# EAGLE design tree (EAGLE 7.7.0)
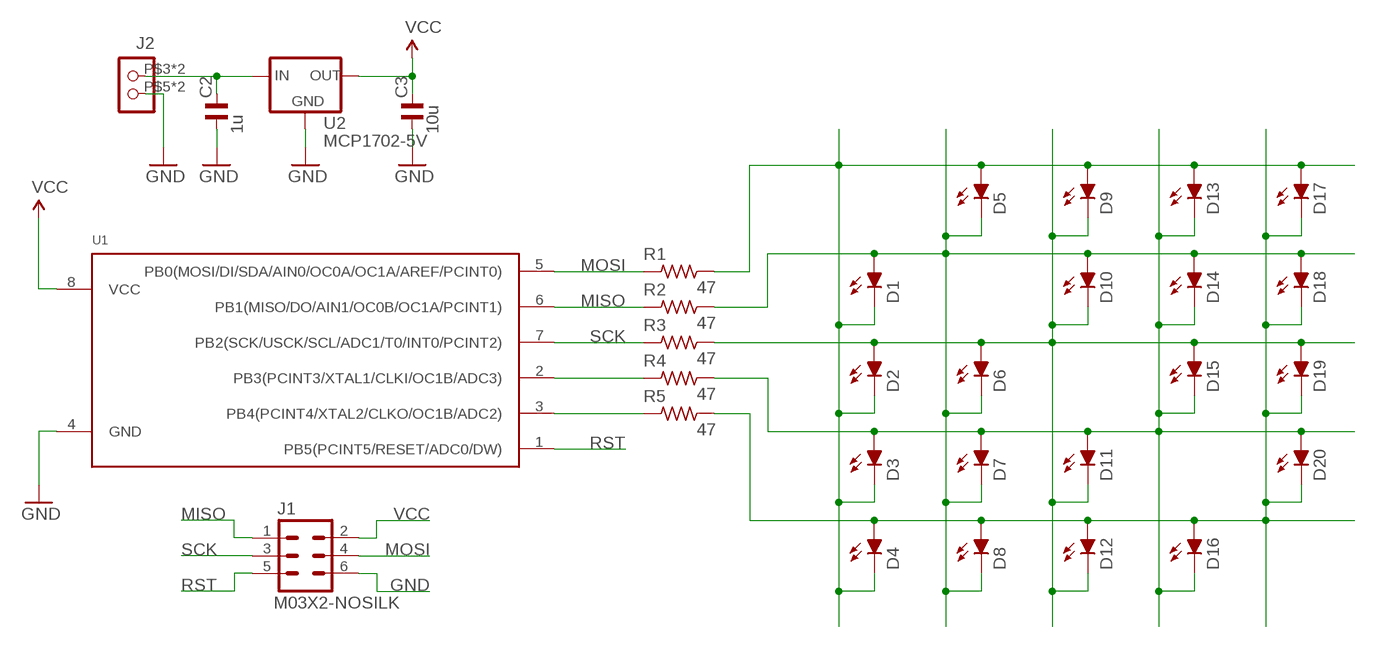
[diagram p0: schematic, sheet 1]

## Parts
C2  1u  C_0805NOSILK  [C0805NOSILK]
C3  10u  C_0805NOSILK  [C0805NOSILK]
D1  LEDCHIP-LED0805NOSILK  [CHIP-LED0805NOSILK]
D2  LEDCHIP-LED0805NOSILK  [CHIP-LED0805NOSILK]
D3  LEDCHIP-LED0805NOSILK  [CHIP-LED0805NOSILK]
D4  LEDCHIP-LED0805NOSILK  [CHIP-LED0805NOSILK]
D5  LEDCHIP-LED0805NOSILK  [CHIP-LED0805NOSILK]
D6  LEDCHIP-LED0805NOSILK  [CHIP-LED0805NOSILK]
D7  LEDCHIP-LED0805NOSILK  [CHIP-LED0805NOSILK]
D8  LEDCHIP-LED0805NOSILK  [CHIP-LED0805NOSILK]
D9  LEDCHIP-LED0805NOSILK  [CHIP-LED0805NOSILK]
D10  LEDCHIP-LED0805NOSILK  [CHIP-LED0805NOSILK]
D11  LEDCHIP-LED0805NOSILK  [CHIP-LED0805NOSILK]
D12  LEDCHIP-LED0805NOSILK  [CHIP-LED0805NOSILK]
D13  LEDCHIP-LED0805NOSILK  [CHIP-LED0805NOSILK]
D14  LEDCHIP-LED0805NOSILK  [CHIP-LED0805NOSILK]
D15  LEDCHIP-LED0805NOSILK  [CHIP-LED0805NOSILK]
D16  LEDCHIP-LED0805NOSILK  [CHIP-LED0805NOSILK]
D17  LEDCHIP-LED0805NOSILK  [CHIP-LED0805NOSILK]
D18  LEDCHIP-LED0805NOSILK  [CHIP-LED0805NOSILK]
D19  LEDCHIP-LED0805NOSILK  [CHIP-LED0805NOSILK]
D20  LEDCHIP-LED0805NOSILK  [CHIP-LED0805NOSILK]
J1  M03X2-NOSILK  [2X03_LOCK_NOSILK]
J2  CON_TERMINAL_HOLES  [TERMINAL_2P_4H]
R1  47  R_0805NOSILK  [R0805NOSILK]
R2  47  R_0805NOSILK  [R0805NOSILK]
R3  47  R_0805NOSILK  [R0805NOSILK]
R4  47  R_0805NOSILK  [R0805NOSILK]
R5  47  R_0805NOSILK  [R0805NOSILK]
U1  ATTINY5-20SU-NOSILK  [SOP8-8S2-NOSILK]
U2  MCP1702-5V  V_REG_MCP170X-CB-NOSILK  [SOT23_NOSILK]

## Nets
GND: C2.1 C3.1 J1.6 J2.P$5 J2.P$6 U1.4(GND) U2.1(GND)
MISO: J1.1 R2.1 U1.6(PB1(MISO/DO/AIN1/OC0B/OC1A/PCINT1))
MOSI: J1.4 R1.1 U1.5(PB0(MOSI/DI/SDA/AIN0/OC0A/OC1A/AREF/PCINT0))
N$1: C2.2 J2.P$3 J2.P$4 U2.3(IN)
N$4: R4.1 U1.2(PB3(PCINT3/XTAL1/CLKI/OC1B/ADC3))
N$5: R5.1 U1.3(PB4(PCINT4/XTAL2/CLKO/OC1B/ADC2))
N$7: D2.A D6.A D9.C D10.C D11.C D12.C D15.A D19.A R3.2
N$8: D1.A D5.C D6.C D7.C D8.C D10.A D14.A D18.A R2.2
N$9: D1.C D2.C D3.C D4.C D5.A D9.A D13.A D17.A R1.2
N$10: D3.A D7.A D11.A D13.C D14.C D15.C D16.C D20.A R4.2
N$11: D4.A D8.A D12.A D16.A D17.C D18.C D19.C D20.C R5.2
RST: J1.5 U1.1(PB5(PCINT5/RESET/ADC0/DW))
SCK: J1.3 R3.1 U1.7(PB2(SCK/USCK/SCL/ADC1/T0/INT0/PCINT2))
VCC: C3.2 J1.2 U1.8(VCC) U2.2(OUT)

## Library data of the parts
C2 C3 = snowflake:C_: NON-POLARIZED CAP
D1-D20 = snowflake:LED: LED Various Types
J1 = snowflake:M03X2: This is a 3x2 pin header Note: This part is based on the Sparkfun M04X2 header.
J2 = adi-misc:CON_TERMINAL_HOLES
R1-R5 = snowflake:R_: RESISTOR
U1 = snowflake:ATTINY*5: Atmel 8-bit AVR Microcontroller with 2/4/8K Bytes In-System Programmable Flash
U2 = snowflake:V_REG_MCP170X

## Board
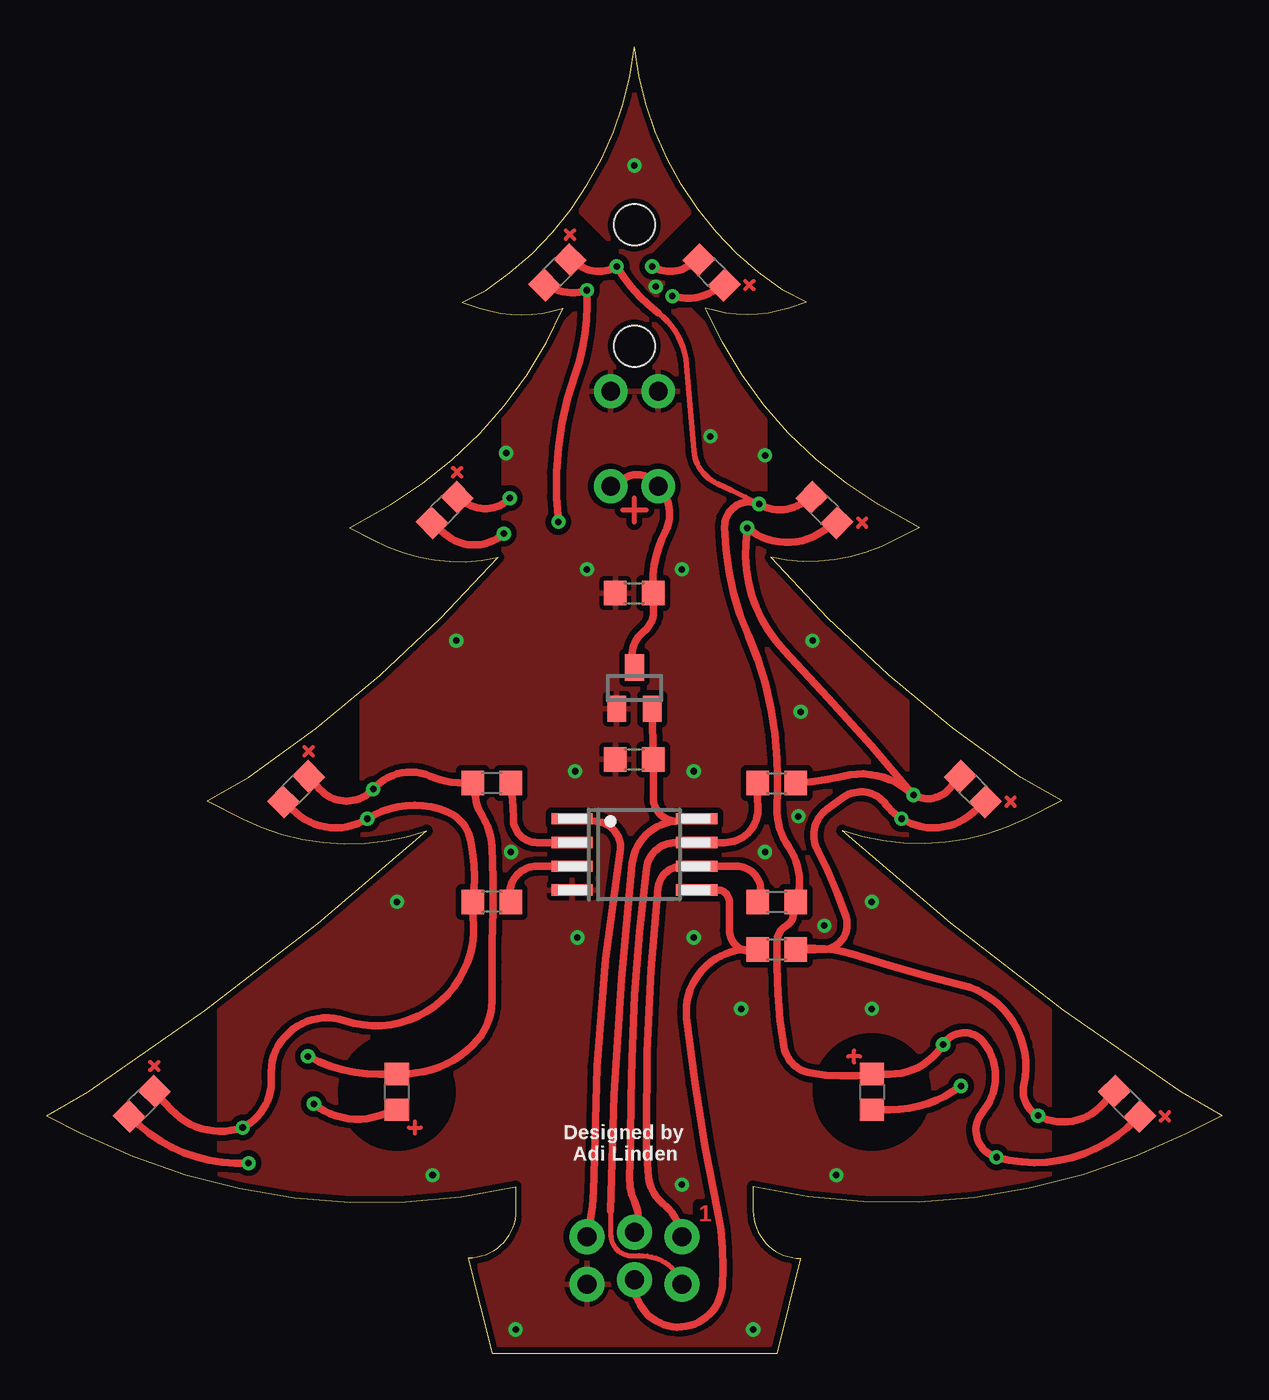
[diagram p1: board, top side]
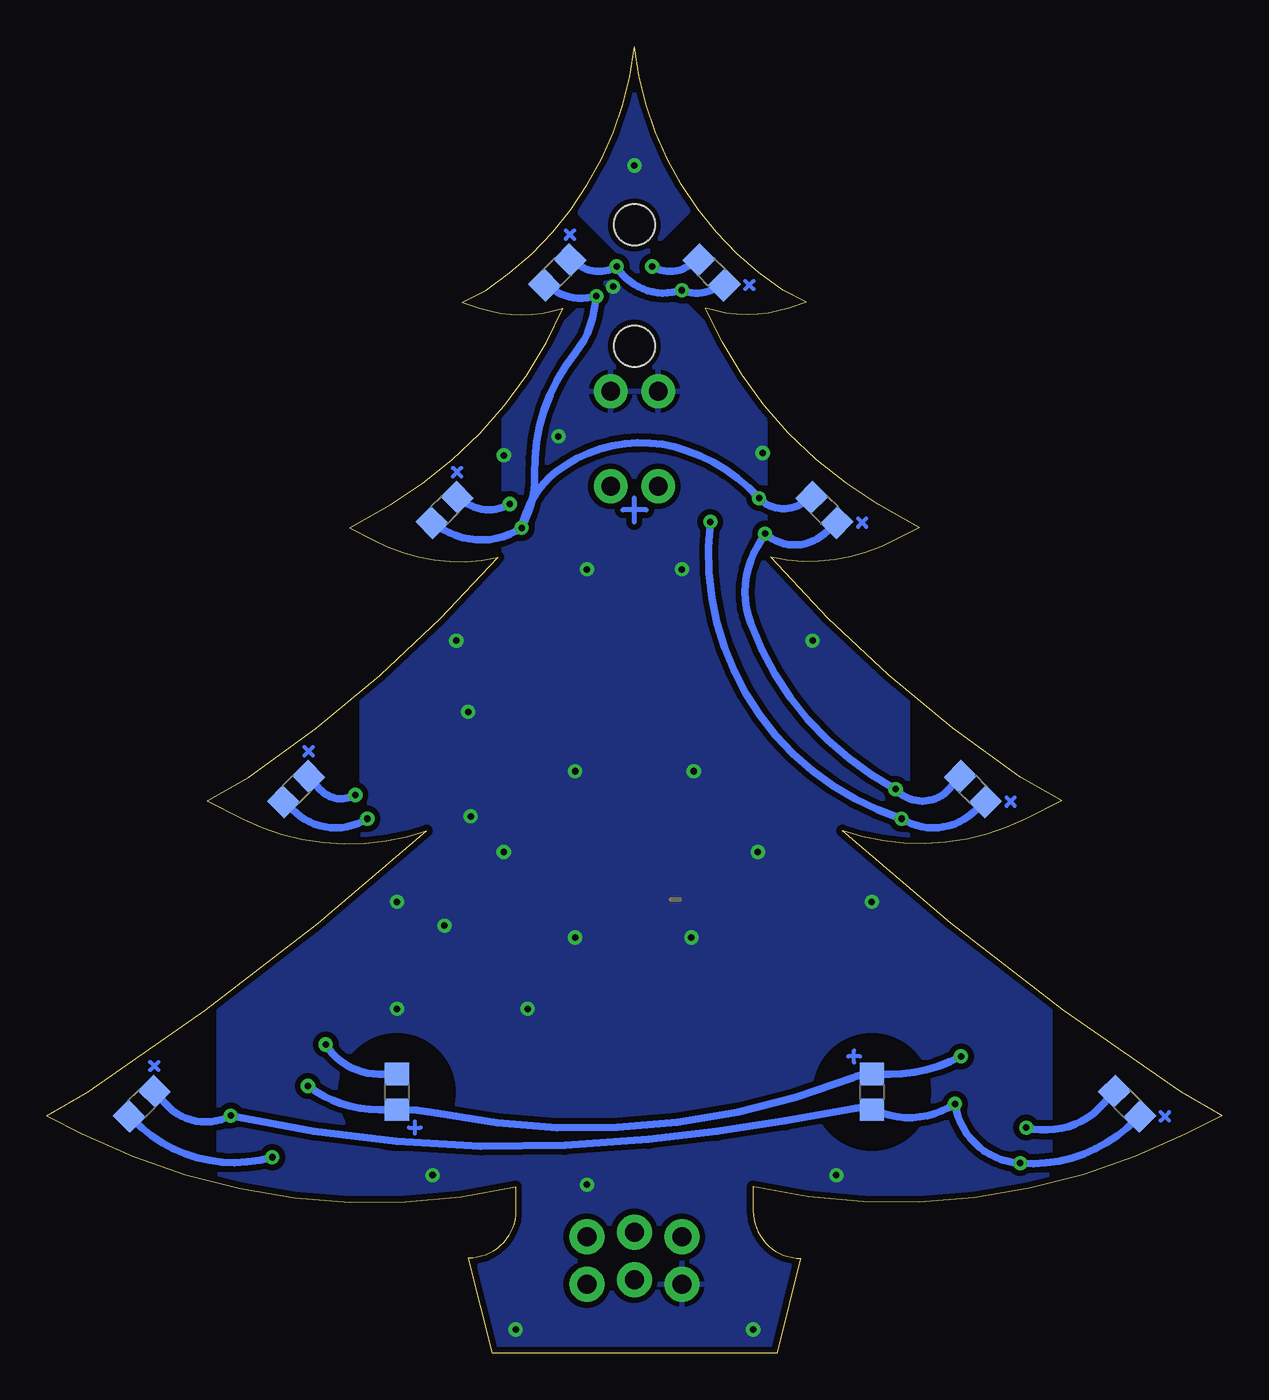
[diagram p2: board, bottom side, seen from below]

Size 62.86 x 69.85 mm. Coordinates in mm from the lower left corner, seen from the top.
Outline: 0,12.7 1.91,11.75 arc39 25.08,8.89 25.08,7.62 arc-90 22.54,5.08 23.81,0 39.05,0 40.32,5.08 arc-90 37.78,7.62 37.78,8.89 arc39 60.96,11.75 62.86,12.7 60.64,13.97 arc-8 42.54,27.94 arc46 52.39,28.57 54.29,29.53 52.07,30.8 arc-14 38.74,42.55 arc41 45.4,43.5 46.67,44.13 44.45,45.4 arc-36 35.24,55.88 arc37 39.69,55.88 40.64,56.2 39.37,56.83 arc-50 31.43,69.85 arc-50 23.49,56.83 22.23,56.2 23.18,55.88 arc37 27.62,55.88 arc-36 18.42,45.4 16.19,44.13 17.46,43.5 arc41 24.13,42.55 arc-14 10.8,30.8 8.57,29.53 10.48,28.57 arc46 20.32,27.94 arc-8 2.22,13.97 0,12.7
Copper layers (1*16): Top 0.035mm / dielectric 1.5mm / Bottom 0.035mm
Design rules "SeeedStudio_2layer_DRU_no_angle_20140221 *": minimum track width 6mil, minimum drill 12mil, track to track 6mil, track to pad 6mil, pad to pad 6mil, via to via 6mil, smd to smd 0mil, copper to edge 10mil, drill to drill 10mil, minimum pad ring 10mil, minimum via ring 8mil, stop-mask expansion 2mil, vias tented up to drill 25mil, thermal gap 10mil
Holes 2.2 mm at 31.43,53.85 31.43,60.33
tRestrict: area -0.3,8.9 to 8.6,19.1; area 54.3,8.9 to 63.2,19.1; area 8.6,26.7 to 16.2,35.6; area 46.7,26.7 to 54.3,35.6; area 16.2,42.3 to 23.8,49.9; area 22,55.5 to 30.2,61.1; area 32.7,55.4 to 40.3,61; area 39.1,42.4 to 46.7,50; area 15.9,11.1 to 21.6,16.8; area 41.3,11.1 to 47,16.8
bRestrict: area 32.7,55.4 to 40.3,61; area 22,55.5 to 30.2,61.1; area 16.2,42.3 to 23.8,49.9; area 8.6,26.7 to 16.2,35.6; area 46.7,26.7 to 54.3,35.6; area -0.3,8.9 to 8.6,19.1; area 54.3,8.9 to 63.2,19.1; area 39.1,42.4 to 46.7,50; area 15.9,11.1 to 21.6,16.8; area 41.3,11.1 to 47,16.8

### Footprints (pad centres in the part's own frame; a part is rotated, then mirrored left to right if it is on the bottom)
C0805NOSILK = smd 1.2 x 1.3: 1 -1.016,0; 2 1.016,0
CHIP-LED0805NOSILK = smd 1.3 x 1.2: A 0,-0.953; C 0,0.953
2X03_LOCK_NOSILK = drill 1.016 pad 1.88: 1 -2.54,-1.143; 2 -2.54,1.397; 3 0,-1.397; 4 0,1.143; 5 2.54,-1.143; 6 2.54,1.397
TERMINAL_2P_4H = drill 1 pad 1.8: P$3 -2.54,1.27; P$4 -2.54,-1.27; P$5 2.54,1.27; P$6 2.54,-1.27
R0805NOSILK = smd 1.2 x 1.3: 1 -1.016,0; 2 1.016,0
SOP8-8S2-NOSILK = smd 0.6 x 2.2: 1 -1.905,-3.33; 2 -0.635,-3.33; 3 0.635,-3.33; 4 1.905,-3.33; 5 1.905,3.33; 6 0.635,3.33; 7 -0.635,3.33; 8 -1.905,3.33
SOT23_NOSILK = smd 1 x 1.4: 1 -0.95,-1.1; 2 0.95,-1.1; 3 0,1.1

### Placement (x,y rotation side)
C2  31.43,40.64 0 top
C3  31.43,31.75 0 top
D1  57.78,13.34 45 top
D2  49.53,30.16 135 bottom
D3  18.73,13.97 180 bottom
D4  5.08,13.34 135 top
D5  57.78,13.34 135 bottom
D6  41.59,45.09 45 top
D7  44.13,13.97 0 bottom
D8  27.3,57.78 45 bottom
D9  49.53,30.16 45 top
D10  41.59,45.09 135 bottom
D11  21.27,45.09 45 bottom
D12  35.56,57.78 135 bottom
D13  18.73,13.97 0 top
D14  44.13,13.97 180 top
D15  21.27,45.09 135 top
D16  13.33,30.16 45 bottom
D17  5.08,13.34 45 bottom
D18  27.3,57.78 135 top
D19  35.56,57.78 45 top
D20  13.33,30.16 135 top
J1  31.43,5.08 180 top
J2  31.43,48.9 90 top
R1  39.05,21.59 0 top
R2  39.05,24.13 0 top
R3  39.05,30.48 0 top
R4  23.81,30.48 180 top
R5  23.81,24.13 180 top
U1  31.43,26.67 270 top
U2  31.43,35.56 0 top

### Tracks (layer width: path | path; a pad name or v marks a point on that pad's centre or on a via)
GND  (via drill 0.35)
  other vias: 28.89,41.91 33.97,41.91 35.5,49.02 38.42,48.01 21.91,38.1 40.96,38.1 34.61,31.11 28.26,31.11 40.32,34.29 24.83,26.8 38.42,26.8 18.73,24.13 44.13,24.13 40.2,28.7 41.59,22.86 34.61,22.23 28.38,22.23 20.64,9.53 42.23,9.53 44.13,18.41 33.97,9.02 37.78,1.27 25.08,1.27 37.15,18.41 24.57,48.13 32.58,57.02 31.43,63.5
  pour Top (isolate 0.305): -0.32,0 63.18,0 63.18,69.85 -0.32,69.85
  pour Bottom (isolate 0.305): -0.32,0 -0.32,69.85 63.18,69.85 63.18,0
MISO
  Top 0.406: R2.1 arc118 36.89,26.04 U1.6 33.97,26.04 arc84 32.7,24.89 arc7 32.07,11.68 arc5 32.19,9.4 arc46 32.96,8 arc-43 J1.1
MOSI
  Top 0.406: U1.5 35.88,24.77 arc-90 36.51,24.13 36.51,22.61 arc113 R1.1 37.53,21.59 arc96 34.23,17.91 arc6 35.88,7.62 arc-17 36.13,3.56 arc-180 J1.4
N$1
  Top 0.406: U2.3 arc-74 31.94,38.61 arc60 32.45,39.88 arc-16 C2.2 arc-32 33.08,43.94 arc72 J2.P$4 32.45,46.61 arc90 30.67,46.61 arc-37 J2.P$3
N$4
  Top 0.406: U1.2 26.23,27.3 arc-90 24.96,28.57 arc8 R4.1
N$5
  Top 0.406: U1.3 26.23,26.04 arc107 R5.1
N$7  (via drill 0.35)
  Top 0.406: D11.C 22.54,45.4 arc78 v24.76,45.72 | D9.C 48.26,30.16 arc-78 v46.35,29.84 | D10.C 41.28,43.81 arc-72 v37.46,44.13 37.4,43.31 arc48 39.43,37.59 arc-4 v46.35,29.84 | D12.C 35.62,56.77 arc-45 v33.46,56.52 | v46.35,29.84 46.04,30.1 arc52 42.61,30.86 arc-10 R3.2
  Bottom 0.406: D11.C 22.54,45.4 arc78 v24.76,45.72 arc-28 28.64,48.26 arc-57 35.62,47.12 arc-41 v37.46,44.13 | D9.C 48.26,30.16 arc-78 v46.35,29.84 | D10.C 41.65,44.04 arc-65 v37.46,44.13 | D12.C 35.62,56.77 arc-45 v33.46,56.52 33.59,55.75 arc29 34.61,53.47 arc-40 36.77,46.99 arc31 v37.46,44.13
N$8  (via drill 0.35)
  Top 0.305: 32.7,55.63 arc-48 34.23,52.83 arc1 34.61,48.26 arc61 35.88,46.48 arc-4 v38.1,45.4
  Top 0.406: D8.C 28.57,58.1 arc62 v30.48,58.1 arc22 32.7,55.63 | D5.C 57.78,12.06 arc-57 v50.8,10.48 arc-117 50.1,12.95 arc77 50.1,16.64 arc109 v47.94,16.51 arc-58 45.09,14.92 D7.C arc-18 40.83,14.99 arc-70 39.43,16.38 arc-10 39.05,20.7 arc0 39.05,21.97 arc-59 39.56,22.86 arc57 39.94,23.5 arc-17 R2.2 arc55 39.69,27.05 arc-37 39.05,29.21 arc4 39.05,31.75 arc22 37.53,38.35 arc-23 36.26,44.2 arc-115 v38.1,45.4 arc62 40.32,45.4 D6.C
  Bottom 0.406: D8.C 28.57,58.1 arc62 v30.48,58.1 | D5.C 57.78,12.06 arc-57 v50.8,10.48 | D6.C 40.32,45.4 arc-62 v38.1,45.4 | D7.C 45.09,14.92 arc58 v47.94,16.51
N$9  (via drill 0.35)
  Top 0.406: D4.C 4.92,12.21 arc45 v10.8,10.16 | D1.C 56.52,13.34 arc-76 v53.02,12.7 arc-75 52.26,14.35 arc89 48.96,19.68 arc-4 43.12,21.34 arc26 R1.2 arc10 41.59,21.59 arc104 42.74,23.37 arc7 41.21,26.92 arc-80 41.72,29.08 arc-2 42.61,29.72 arc-88 44.89,29.34 arc21 v45.72,28.57 arc74 49.53,28.89 D2.C | D2.C | D3.C 17.78,12.7 arc-57 v14.29,13.34
  Bottom 0.406: D4.C 5.08,12.06 arc46 v10.8,10.16 arc78 v14.29,13.34 arc52 18.16,12.83 D3.C arc-30 19.75,13.08 arc5 30.67,11.43 arc18 v53.02,12.7 arc76 56.52,13.34 D1.C | D2.C 49.53,28.89 arc-74 v45.72,28.57
N$10  (via drill 0.35)
  Top 0.406: D15.C 21.27,43.81 arc83 v24.45,43.81 | D16.C 14.6,30.16 arc97 v17.46,30.16 arc-71 20.51,30.86 arc26 R4.2 22.92,29.72 arc22 23.3,28.7 arc-29 23.81,27.05 arc-5 23.81,21.97 arc-1 23.81,18.8 arc-40 23.05,16.76 arc-42 19.75,14.99 arc-7 D13.C 17.78,14.92 arc-28 v13.97,15.88 | D14.C 45.09,13.02 arc37 v48.89,14.29
  Bottom 0.406: D15.C 21.27,43.81 arc83 v24.45,43.81 24.83,43.18 arc-52 25.21,38.99 arc-41 v17.46,30.16 arc-97 14.6,30.16 D16.C | v13.97,15.88 arc28 17.78,14.92 D13.C arc-21 19.75,14.73 arc33 41.97,12.83 arc-13 D14.C 45.09,13.02 arc37 v48.89,14.29
N$11  (via drill 0.35)
  Top 0.406: D18.C 27.19,56.88 arc42 v28.89,56.83 28.89,56.01 arc-20 28.26,52.32 arc26 v27.37,44.45 | D19.C 34.29,58.1 arc-62 v32.39,58.1 | D20.C 13.33,28.89 arc74 v17.14,28.57 arc-54 21.4,28.96 arc-57 22.67,27.43 arc-18 R5.2 arc14 22.8,23.37 arc-116 15.94,17.78 arc113 12,14.73 arc-68 v10.48,12.06 arc-67 6.67,13.02 D17.C
  Bottom 0.406: D18.C 27.3,56.83 arc45 v28.89,56.83 29.15,56.77 arc73 v32.39,58.1 arc62 34.29,58.1 D19.C | D20.C | D20.C 13.33,28.89 arc74 v17.14,28.57 arc79 v27.37,44.45 | D17.C 6.35,13.34 arc63 v10.48,12.06
RST
  Top 0.406: U1.1 29.4,28.45 arc-94 30.67,26.8 arc9 29.27,9.53 arc-13 J1.5
SCK
  Top 0.406: R3.1 arc8 38.04,29.21 arc-94 36.26,27.3 U1.7 33.65,27.3 arc83 32.07,25.91 arc6 31.31,15.75 arc0 31.18,9.27 arc27 31.43,8.13 arc-52 J1.3
VCC
  Top 0.254: 30.16,7.62 arc2 30.16,6.35 arc94 31.43,5.21 arc-23 32.58,5.08 arc-54 J1.2
  Top 0.406: U1.8 33.59,28.45 | 33.59,28.45 arc78 31.31,26.16 arc5 30.16,7.62 | U2.2 C3.2 arc-3 32.45,29.72 arc87 33.59,28.45

### Text on the board
tPlace: Designed by | Adi Linden